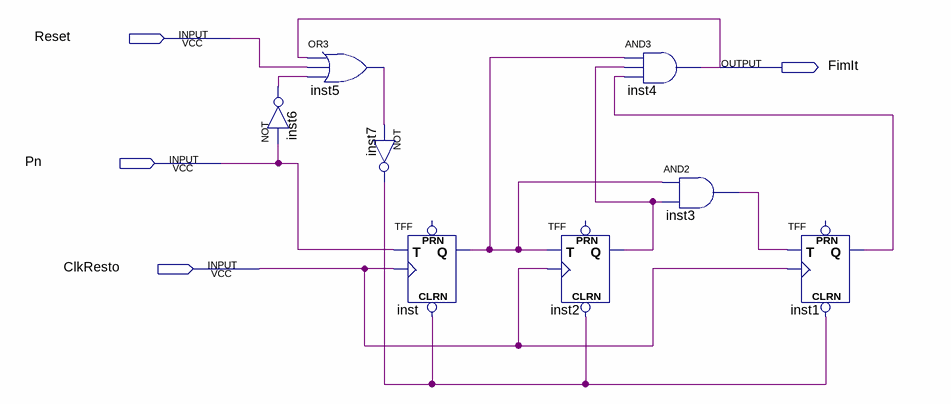
[diagram p0: schematic sheet]
// Quartus schematic ContadorIt.bdf as structural Verilog: 8 symbols, 4 pins
module ContadorIt (
  input  Reset,
  input  Pn,
  input  ClkResto,
  output FimIt
);

  wire inst1_q, inst2_q, inst3_out, inst5_out, inst6_out, inst7_out, inst_q;

  or inst5 (inst5_out, FimIt, Reset, inst6_out);
  not inst6 (inst6_out, Pn);
  not inst7 (inst7_out, inst5_out);
  TFF inst (.CLRN(inst7_out), .T(Pn), .CLK(ClkResto), .Q(inst_q));  // open: PRN
  TFF inst2 (.CLRN(inst7_out), .T(inst_q), .CLK(ClkResto), .Q(inst2_q));  // open: PRN
  and inst4 (FimIt, inst_q, inst2_q, inst1_q);
  and inst3 (inst3_out, inst_q, inst2_q);
  TFF inst1 (.CLRN(inst7_out), .T(inst3_out), .CLK(ClkResto), .Q(inst1_q));  // open: PRN
endmodule
